# EAGLE design 2te8LED_v04 (EAGLE 9.6.2)
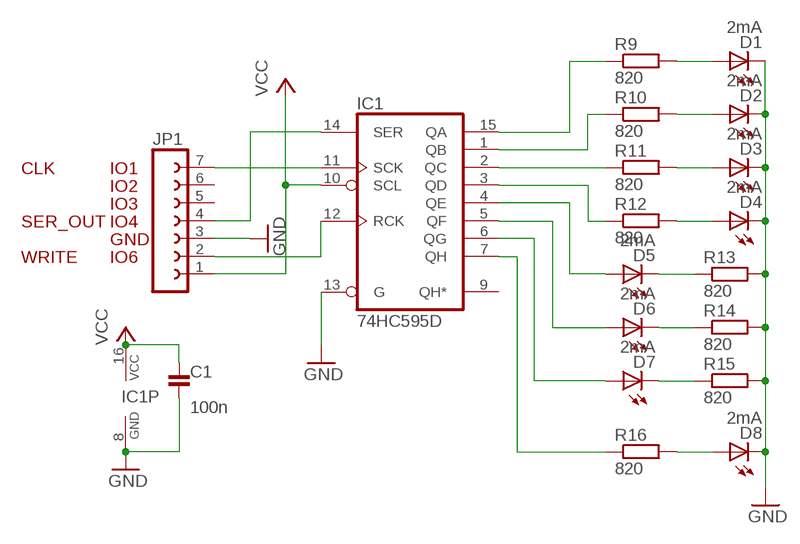
[diagram p0: schematic, sheet 1]

## Parts
C1  100n  C-EUC0805  [C0805]
D1  2mA  LED3MM  [LED3MM]
D2  2mA  LED3MM  [LED3MM]
D3  2mA  LED3MM  [LED3MM]
D4  2mA  LED3MM  [LED3MM]
D5  2mA  LED3MM  [LED3MM]
D6  2mA  LED3MM  [LED3MM]
D7  2mA  LED3MM  [LED3MM]
D8  2mA  LED3MM  [LED3MM]
IC1  74HC595D  [SO16]
JP1  FE07-1  [FE07]
R9  820  R-EU_R0805  [R0805]
R10  820  R-EU_R0805  [R0805]
R11  820  R-EU_R0805  [R0805]
R12  820  R-EU_R0805  [R0805]
R13  820  R-EU_R0805  [R0805]
R14  820  R-EU_R0805  [R0805]
R15  820  R-EU_R0805  [R0805]
R16  820  R-EU_R0805  [R0805]

## Nets
GND: C1.2 D1.K(C) D2.K(C) D3.K(C) D4.K(C) D8.K(C) IC1.8(GND) IC1.13(G) JP1.3 R13.2 R14.2 R15.2
IO1: IC1.11(SCK) JP1.7
IO4: IC1.14(SER) JP1.4
IO6: IC1.12(RCK) JP1.2
N$20: IC1.15(QA) R9.1
N$21: IC1.1(QB) R10.1
N$22: IC1.2(QC) R11.1
N$23: IC1.3(QD) R12.1
N$24: D5.A IC1.4(QE)
N$25: D6.A IC1.5(QF)
N$26: D7.A IC1.6(QG)
N$29: D1.A R9.2
N$30: D2.A R10.2
N$31: D3.A R11.2
N$32: D4.A R12.2
N$33: D5.K(C) R13.1
N$34: D6.K(C) R14.1
N$35: D7.K(C) R15.1
N$36: IC1.7(QH) R16.1
N$37: D8.A R16.2
VCC: C1.1 IC1.10(SCL) IC1.16(VCC) JP1.1
Unconnected: IC1.9(QH*) JP1.5 JP1.6

## Notes on the sheet
- CLK | IO1
- IO2
- IO3
- SER_OUT | IO4
- GND
- WRITE | IO6

## Library data of the parts
C1 = MyRCL:C-EU: CAPACITOR, European symbol; SPICEPREFIX: C
D1-D8 = led:LED: LED OSRAM: - CHIPLED LG R971, LG N971, LY N971, LG Q971, LY Q971, LO R971, LY R971 LH N974, LH R974 LS Q976, LO Q976, LY Q976 LO Q996 - Hyper CHIPLED LW Q18S LB Q993, LB Q99A, LB R99A - SideLED LS A670, LO A670, LY A670, LG A670, LP A670 LB A673, LV A673, LT A673, LW A673 LH A674 LY A675 LS A676, LA A676, LO A676, LY A676, LW A676 LS A679, LY A679, LG A679 - Hyper Micro SIDELED® LS Y876, LA Y876, LO Y876, LY Y876 LT Y87S - SmartLED LW L88C, LW L88S LB L89C, LB L89S, LG L890 LS L89K, LO L89K, LY L89K LS L896, LA L896, LO L896, LY L896 - TOPLED LS T670, LO T670, LY T670, LG T670, LP T670 LSG T670, LSP T670, LSY T670, LOP T670, LYG T670 LG T671, LOG T671, LSG T671 LB T673, LV T673, LT T673, LW T673 LH T674 LS T676, LA T676, LO T676, LY T676, LB T676, LH T676, LSB T676, LW T676 LB T67C, LV T67C, LT T67C, LS T67K, LO T67K, LY T67K, LW E67C LS E67B, LA E67B, LO E67B, LY E67B, LB E67C, LV E67C, LT E67C LW T67C LS T679, LY T679, LG T679 LS T770, LO T770, LY T770, LG T770, LP T770 LB T773, LV T773, LT T773, LW T773 LH T774 LS E675, LA E675, LY E675, LS T675 LS T776, LA T776, LO T776, LY T776, LB T776 LHGB T686 LT T68C, LB T68C - Hyper Mini TOPLED® LB M676 - Mini TOPLED Santana® LG M470 LS M47K, LO M47K, LY M47K Source: http://www.osram.convergy.de - LUMILED® LXK2-PW12-R00, LXK2-PW12-S00, LXK2-PW14-U00, LXK2-PW14-V00 LXK2-PM12-R00, LXK2-PM12-S00, LXK2-PM14-U00 LXK2-PE12-Q00, LXK2-PE12-R00, LXK2-PE12-S00, LXK2-PE14-T00, LXK2-PE14-U00 LXK2-PB12-K00, LXK2-PB12-L00, LXK2-PB12-M00, LXK2-PB14-N00, LXK2-PB14-P00, LXK2-PB14-Q00 LXK2-PR12-L00, LXK2-PR12-M00, LXK2-PR14-Q00, LXK2-PR14-R00 LXK2-PD12-Q00, LXK2-PD12-R00, LXK2-PD12-S00 LXK2-PH12-R00, LXK2-PH12-S00 LXK2-PL12-P00, LXK2-PL12-Q00, LXK2-PL12-R00 Source: www.luxeon.com
IC1 = 74xx-eu:74*595: 8-bit SHIFT REGISTER, output latch
JP1 = con-lsta:FE07-1: FEMALE HEADER; OC_FARNELL: unknown; OC_NEWARK: unknown
R9-R16 = MyRCL:R-EU_: RESISTOR, European symbol

## Board
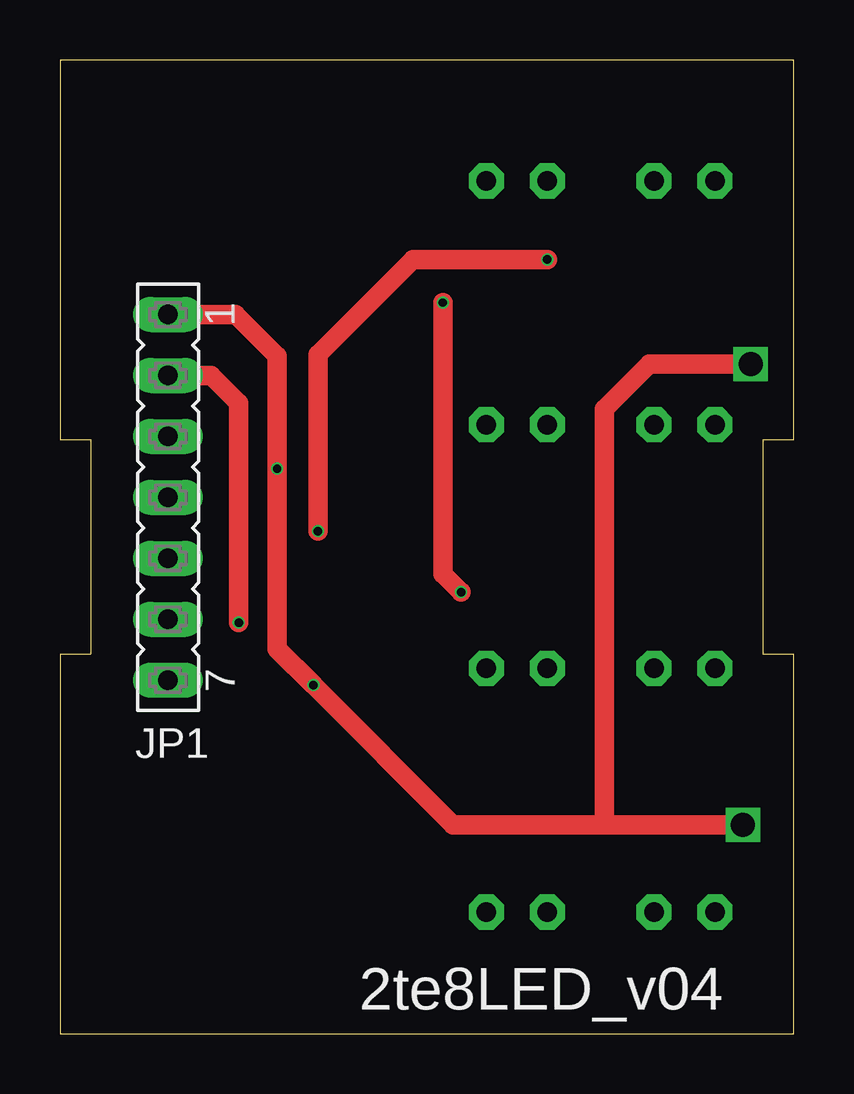
[diagram p1: board, top side]
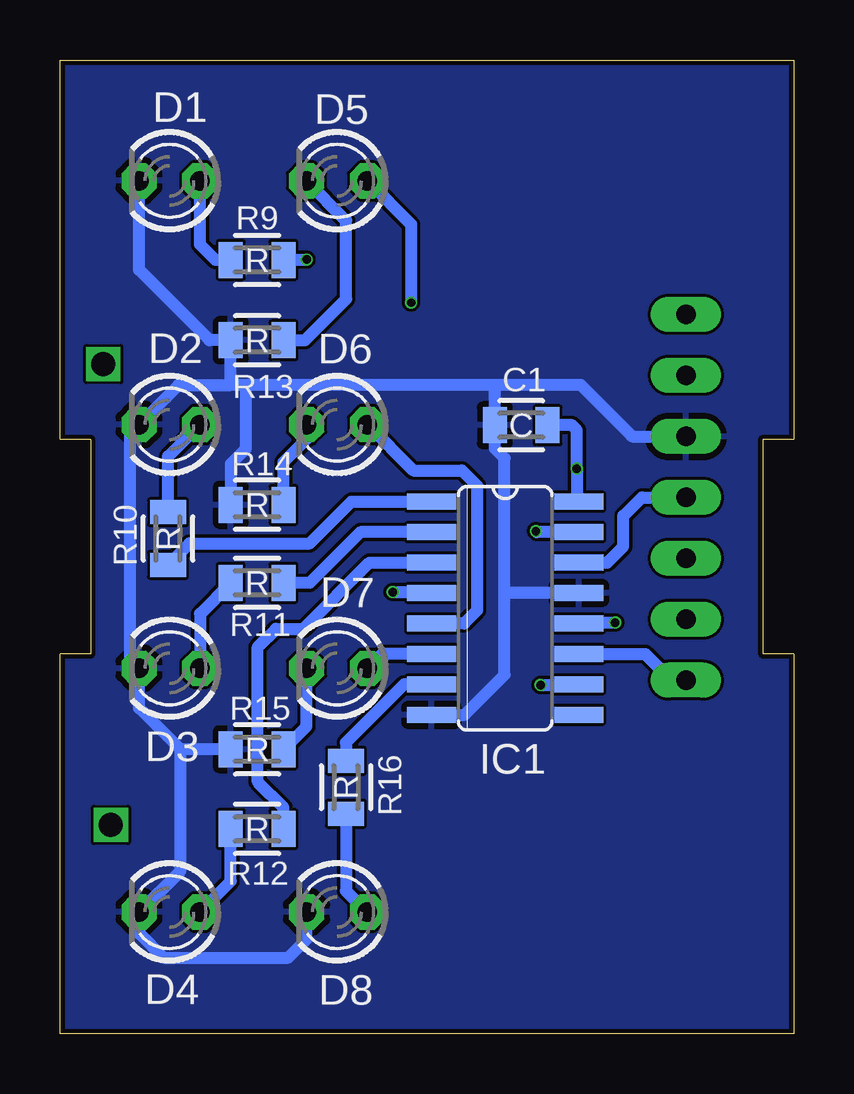
[diagram p2: board, bottom side, seen from below]

Size 30.6 x 40.6 mm. Coordinates in mm from the lower left corner, seen from the top.
Outline: 30.6,40.6 0,40.6 0,24.77 1.29,24.77 1.29,15.83 0,15.83 0,0 30.6,0 30.6,15.83 29.31,15.83 29.31,24.77 30.6,24.77 30.6,40.6
Copper layers (1*16): Top 0.035mm / dielectric 1.6mm / Bottom 0.035mm
Design rules "jlcpcb-2layers": minimum track width 5mil, minimum drill 0.3mm, track to track 5mil, track to pad 5mil, pad to pad 5mil, via to via 5mil, smd to smd 5mil, copper to edge 0.2mm, drill to drill 6mil, minimum pad ring 10mil, minimum via ring 3mil, stop-mask expansion 4mil, vias tented up to drill 0mil, thermal gap 10mil

### Footprints (pad centres in the part's own frame; a part is rotated, then mirrored left to right if it is on the bottom)
C0805 = smd 1 x 1.5: 1 -1.1,0; 2 1.1,0
LED3MM = drill 0.813 octagon: A -1.27,0; K 1.27,0
SO16 = smd 0.66 x 2.032: 1 -4.445,-3.073; 2 -3.175,-3.073; 3 -1.905,-3.073; 4 -0.635,-3.073; 5 0.635,-3.073; 6 1.905,-3.073; 7 3.175,-3.073; 8 4.445,-3.073; 9 4.445,3.073; 10 3.175,3.073; 11 1.905,3.073; 12 0.635,3.073; 13 -0.635,3.073; 14 -1.905,3.073; 15 -3.175,3.073; 16 -4.445,3.073
FE07 = drill 0.813 long: 1 -7.62,0; 2 -5.08,0; 3 -2.54,0; 4 0,0; 5 2.54,0; 6 5.08,0; 7 7.62,0
R0805 = smd 1 x 1.5: 1 -1.1,0; 2 1.1,0

### Placement (x,y rotation side)
C1  11.37,25.37 180 bottom
D1  26.04,35.56 180 bottom
D2  26.04,25.4 180 bottom
D3  26.04,15.24 180 bottom
D4  26.04,5.08 180 bottom
D5  19.05,35.56 180 bottom
D6  19.05,25.4 180 bottom
D7  19.05,15.24 180 bottom
D8  19.05,5.08 180 bottom
IC1  12.04,17.74 270 bottom
JP1  4.51,22.37 270 top
R9  22.38,32.26 180 bottom
R10  26.09,20.65 90 bottom
R11  22.38,18.8 180 bottom
R12  22.38,8.55 180 bottom
R13  22.38,28.91 180 bottom
R14  22.38,22.05 180 bottom
R15  22.38,11.86 180 bottom
R16  18.67,10.28 270 bottom

### Tracks (layer width: path | path; a pad name or v marks a point on that pad's centre or on a via)
GND
  Bottom 0.406: 12.47,27.05 14.35,27.05 | D2.K 27.69,25.02
  Bottom 0.508: D1.K 27.3,31.85 24.37,28.91 R13.2 23.48,27.05 | D2.K 25.65,27.05 23.48,27.05 | 22.86,27.05 22.86,24.38 23.48,23.77 R14.2 | 12.47,27.05 C1.2 12.47,24.41 12.06,24 12.06,18.29 | 22.86,27.05 14.35,27.05 8.89,27.05 6.79,24.96 | 22.86,27.05 23.48,27.05 | 27.69,25.02 27.69,15.62 D3.K 27.3,13.59 25.58,11.86 | R15.2 25.58,11.86 | 25.58,11.86 25.58,6.81 D4.K 27.3,4.19 26.29,3.17 21.08,3.17 20.32,3.94 D8.K | 6.75,24.91 6.79,24.96 | 6.79,24.96 6.75,24.91 | 6.75,24.91 JP1.3 | IC1.8 13.73,13.3 12.06,14.97 12.06,18.29 | IC1.13 11.97,18.38 12.06,18.29
  pour Bottom: 30.61,0 30.61,40.51 0,40.51 0,0
IO1
  Bottom 0.508: IC1.11 6.19,15.84 5.09,14.75 JP1.7
IO4
  Bottom 0.508: IC1.14 7.78,19.65 7.11,20.32 7.11,21.59 6.33,22.37 JP1.4
IO6  (via drill 0.35)
  Top 0.813: v7.45,17.15 7.45,26.29 6.3,27.45 JP1.2
  Bottom 0.406: IC1.12 8.93,17.15
  Bottom 0.508: 8.93,17.15 v7.45,17.15
N$20  (via drill 0.35)
  Top 0.813: v10.76,20.96 10.76,28.32 14.71,32.28 v20.32,32.28
  Bottom 0.406: 10.71,20.92 v10.76,20.96 | 21.42,32.28 21.38,32.26 R9.1
  Bottom 0.508: IC1.15 10.71,20.92 | 21.42,32.28 v20.32,32.28
N$21
  Bottom 0.508: R10.1 25.2,20.45 20.19,20.45 18.45,22.19 IC1.1
N$22
  Bottom 0.508: IC1.2 18.07,20.92 20.19,18.8 R11.1
N$23
  Bottom 0.508: R12.1 21.28,9.43 22.35,10.51 22.35,16.13 21.59,16.89 20.45,16.89 17.69,19.65 IC1.3
N$24  (via drill 0.35)
  Top 0.813: v15.96,30.48 15.96,19.18 v16.72,18.42
  Bottom 0.406: 15.15,18.42 IC1.4
  Bottom 0.508: D5.A 15.96,33.74 v15.96,30.48 | v16.72,18.42 15.15,18.42
N$25
  Bottom 0.508: D6.A 15.88,23.5 13.84,23.5 13.21,22.86 13.21,17.65 13.75,17.11 IC1.5
N$26
  Bottom 0.508: IC1.6 17.18,15.84 D7.A
N$29
  Bottom 0.508: R9.2 24.11,32.26 24.77,32.91 D1.A
N$30
  Bottom 0.508: R10.2 26.09,24.07 D2.A
N$31
  Bottom 0.508: R11.2 24.77,17.51 D3.A
N$32
  Bottom 0.508: D4.A 23.48,6.37 R12.2
N$33
  Bottom 0.508: R13.1 20.39,28.91 18.67,30.63 18.67,33.91 D5.K
N$34
  Bottom 0.508: R14.1 21.28,23.83 20.32,24.79 D6.K
N$35
  Bottom 0.508: R15.1 20.32,12.82 D7.K
N$36
  Bottom 0.508: IC1.7 16.25,14.57 18.67,12.14 R16.1
N$37
  Bottom 0.508: R16.2 18.67,5.97 D8.A
VCC  (via drill 0.35, 1 pad 1.42)
  Top 0.406: 22.69,8.77 22.75,8.71
  Top 0.813: v28.79,27.92 24.58,27.92 22.69,26.04 22.69,8.77 | v28.48,8.71 24.27,8.71 22.75,8.71 16.39,8.71 v10.56,14.55 9.05,16.06 v9.05,23.56 9.05,28.25 7.32,29.99 JP1.1
  Bottom 0.406: IC1.16 9.05,22.28 | IC1.10 8.99,14.55
  Bottom 0.508: 9.05,22.28 v9.05,23.56 9.05,25.17 9.26,25.37 C1.1 | v10.56,14.55 8.99,14.55

### Text on the board
tPlace: 2te8LED_v04